# EAGLE design trans-magstripe (EAGLE 5.11)
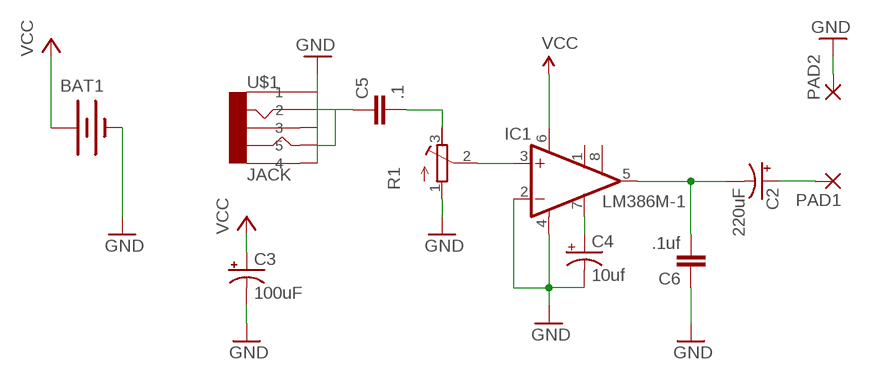
[diagram p0: schematic, sheet 1]

## Parts
BAT1  BATTERYCR123A  [BATTERY_CR123A]
C2  220uF  CAP_POL7343  [EIA7343]
C3  100uF  CAP_POL7343  [EIA7343]
C4  10uf  CAP_POL1206  [EIA3216]
C5  .1  CAP0805  [0805]
C6  .1uf  CAP0805  [0805]
IC1  LM386M-1  [SO08]
PAD1  SMD5  [SMD2,54-5,08]
PAD2  SMD5  [SMD2,54-5,08]
R1  R-TRIMM3103  [RTRIM3103]
U$1  JACK  AUDIO-JACK22.5MM-SMD-NSL  [NSL_2.5MMJACK_SMD]

## Nets
GND: BAT1.- C3.C(-) C4.C(-) C6.1 IC1.2(-IN) IC1.4(GND) PAD2.1(P) R1.1(E) U$1.2 U$1.2@2
N$3: C2.A(+) PAD1.1(P)
N$5: C2.C(-) C6.2 IC1.5(OUT)
N$6: C5.2 R1.3(A)
N$7: IC1.3(+IN) R1.2(S)
N$8: C5.1 U$1.1 U$1.3
N$9: C4.A(+) IC1.7(BYPASS)
VCC: BAT1.+ C3.A(+) IC1.6(VS)
Unconnected: IC1.1(GAIN) IC1.8(GAIN) U$1.4

## Library data of the parts
BAT1 = tvbgone-adj:BATTERY: Battery Holders Various common sizes : AA, AAA, 20mm coin cell and 12mm coin cell.
C2-C4 = SparkFun:CAP_POL: Capacitor Polarized These are standard SMD and PTH capacitors. Normally 10uF, 47uF, and 100uF in electrolytic and tantalum varieties. Always verify the external diameter of the through hole cap, it varies with capacity, voltage, and manufacturer. The EIA devices should be standard.
C5 C6 = SparkFun:CAP: Capacitor Standard 0603 ceramic capacitor, and 0.1" leaded capacitor.
IC1 = linear:LM386?-*: Low Voltage Audio Power Amplifier Source: http://cache.national.com/ds/LM/LM386.pdf
PAD1 PAD2 = wirepad:SMD5: SMD PAD
R1 = rcl:R-TRIMM: Trimm resistor
U$1 = trans-magstripe:AUDIO-JACK2

## Board
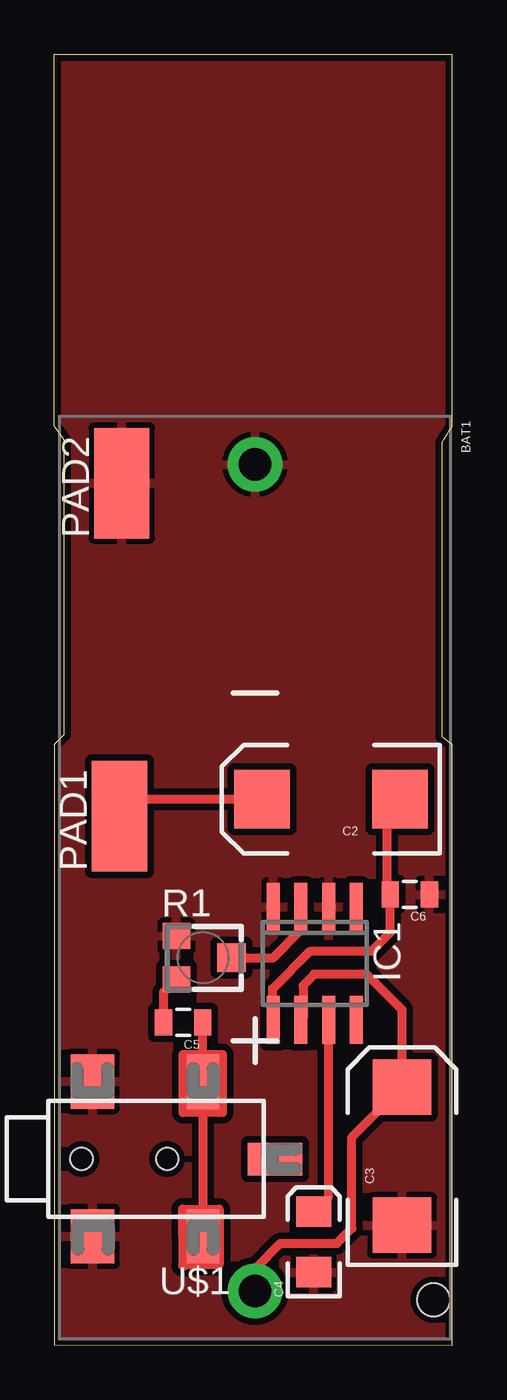
[diagram p1: board, top side]

Size 18.29 x 59.33 mm. Coordinates in mm from the lower left corner, seen from the top.
Outline: 0,0.03 18.29,0 18.29,27.61 17.83,27.97 17.83,41.5 18.29,42.24 18.29,59.33 0,59.33 0,42.24 0.46,41.61 0.46,28.07 0,27.61 0,0.03
Copper layers (1*16): Top 0.0356mm / dielectric 1.5011mm / Bottom 0.0356mm
Design rules "SparkFun-mod": minimum track width 8mil, minimum drill 20mil, track to track 12mil, track to pad 12mil, pad to pad 8mil, via to via 8mil, smd to smd 8mil, copper to edge 12mil, drill to drill 8mil, minimum pad ring 12mil, minimum via ring 10mil, stop-mask expansion 4mil, vias tented up to drill 25mil, thermal gap 10mil

### Footprints (pad centres in the part's own frame; a part is rotated, then mirrored left to right if it is on the bottom)
BATTERY_CR123A = drill 1.5 pad 2.5 round: + 19,0; - -19,0 | hole 1.5: 19.4,8.2
EIA7343 = smd 2.55 x 2.7: A 3.17,0; C -3.17,0
EIA3216 = smd 1.4 x 1.6: A 1.4,0; C -1.4,0
0805 = smd 0.8 x 1.2: 1 -0.9,0; 2 0.9,0
SO08 = smd 0.6 x 2.2: 1 -1.905,-2.6; 2 -0.635,-2.6; 3 0.635,-2.6; 4 1.905,-2.6; 5 1.905,2.6; 6 0.635,2.6; 7 -0.635,2.6; 8 -1.905,2.6
SMD2,54-5,08 = smd 2.54 x 5.08: 1 0,0
RTRIM3103 = smd 1.2 x 1.25: 1 -1,-1.225; 3 1,-1.225 | smd 1.3 x 1.3: 2 0,1.3
NSL_2.5MMJACK_SMD = smd 2.5 x 1.5: 1 3.454,-4.039; 3 -3.658,-4.039 | smd 2.5 x 2: 2 -3.658,1.041; 2@2 3.454,1.041 | smd 1.5 x 2.5: 4 -0.102,-7.341 | hole 1.016: -0.102,1.549; -0.102,-2.388

### Placement (x,y rotation side)
BAT1  9.22,21.49 270 top
C2  12.7,25.1 180 top
C3  15.98,8.69 90 top
C4  11.91,4.75 90 top
C5  5.92,14.83 180 top
C6  16.33,20.73 180 top
IC1  11.96,17.55 180 top
PAD1  3,24.31 0 top
PAD2  3.1,39.62 0 top
R1  6.83,17.81 270 top
U$1  2.79,8.66 90 top

### Tracks (layer width: path | path; a pad name or v marks a point on that pad's centre or on a via)
GND
  pour Top: 18.41,59.59 18.29,0.15 -0.13,0.13 0,59.56
N$3
  Top 0.254: 3.1,25.1 2.95,24.94 2.95,24.36 PAD1.1
  Top 0.406: 3.1,25.1 C2.A
N$5
  Top 0.254: IC1.5 10.03,14.98 | C6.2 15.29,20.87 | 15.29,24.94 15.44,25.1 C2.C
  Top 0.406: 10.03,14.98 10.03,16.38 11.76,18.11 14.58,18.11 15.43,18.96 C6.2 | 15.29,20.87 15.29,24.94
N$6
  Top 0.406: C5.2 5.02,16.22 R1.3
N$7
  Top 0.406: IC1.3 11.33,19.08 10.06,17.81 R1.2
N$8
  Top 0.254: U$1.1 6.82,12.13
  Top 0.406: 6.82,12.13 C5.1 | U$1.3 5.89,5 | 5.89,5 5.89,5.31 | 5.89,5.31 5.89,6.25 7.57,6.25 7.57,3.71 5.99,3.71 5.99,3.66 5.89,3.66 5.89,5 | 5.89,5.31 6.81,5.31 6.81,5.33 6.83,5.33 6.83,11.28 7.54,11.28 7.54,10.69 5.92,10.69 5.92,13.36 7.72,13.36 7.72,10.69 6.83,10.69 U$1.1
N$9
  Top 0.254: C4.A 12.6,6.84
  Top 0.406: 12.6,6.84 IC1.7
VCC
  Top 0.254: 11.43,15.05 IC1.6
  Top 0.406: BAT1.+ 9.22,3.51 10.39,4.67 12.98,4.67 13.66,5.36 13.66,9.55 C3.A 15.98,15.42 14.35,17.04 11.94,17.04 11.43,16.54 11.43,15.05